# Altium schematic sheet Buttons_Buzzer.SchDoc
size A4
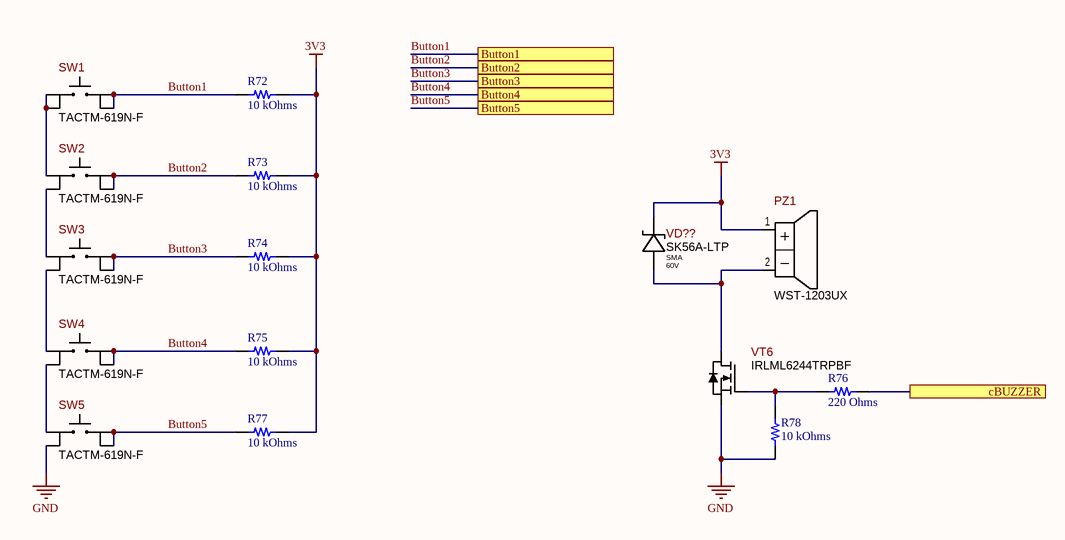
[diagram p0: Buttons_Buzzer.SchDoc]

## Parts
PZ1  WST-1203UX  [WST-1203UX]
R72  10 kOhms  [RES 0805_2012]
R73  10 kOhms  [RES 0805_2012]
R74  10 kOhms  [RES 0805_2012]
R75  10 kOhms  [RES 0805_2012]
R76  220 Ohms  [RES 0805_2012]
R77  10 kOhms  [RES 0805_2012]
R78  10 kOhms  [RES 0805_2012]
SW1  TACTM-619N-F  [TACTM-619N-F]
SW2  TACTM-619N-F  [TACTM-619N-F]
SW3  TACTM-619N-F  [TACTM-619N-F]
SW4  TACTM-619N-F  [TACTM-619N-F]
SW5  TACTM-619N-F  [TACTM-619N-F]
VD??  Package: SMA  Voltage: 60V  [SMA_MED]  (hidden comment: SK56A-LTP)
VT6  IRLML6244  [SOT-23_MED]  (value not drawn)

## Ports
Button1, Button2, Button3, Button4, Button5, cBUZZER

## Nets
3V3: PZ1.1(Positive) R72.1 R73.1 R74.1 R75.1 R77.1 VD??.CA
GND: R78.1 SW5.2 VT6.2(S)
Button1: R72.2 SW1.3 SW1.4 ; port Button1
Button2: R73.2 SW2.3 SW2.4 ; port Button2
Button3: R74.2 SW3.3 SW3.4 ; port Button3
Button4: R75.2 SW4.3 SW4.4 ; port Button4
Button5: R77.2 SW5.3 SW5.4 ; port Button5
cBUZZER: R76.1 ; port cBUZZER
NetPZ1_2: PZ1.2(Negative) VD??.AN VT6.3(D)
NetR76_2: R76.2 R78.2 VT6.1(G)
NetSW1_1: SW1.1 SW1.2 SW2.1
NetSW2_2: SW2.2 SW3.1
NetSW3_2: SW3.2 SW4.1
NetSW4_2: SW4.2 SW5.1

## Library data of the parts
PZ1 = WST-1203UX: Buzzers Indicator, Internally Driven Magnetic 3V 30mA 2.3kHz 82dB @ 3V, 10cm Through Hole; Manufacturer: Soberton; Ajax_1C_PN: NONE; Ajax_1С_Status: RND Only; Component Status: Released; Part Type: Buzzer; Component Type: PTH; Temperature Range: -20°C ~ 60°C; ComponentLink1URL: https://www.soberton.com/wp-content/uploads/2019/02/WST-1203UX.-17-Feb-2019-pdf.pdf; Supplier 1: Digi-Key; Supplier Part Number 1: 433-1047-ND; Replacement: NONE; Price: NONE; ComponentLink1Description: Datasheet; Part Number: WST-1203UX
R72-R75 R77 R78 = RNCS0805BKE10K0: RES 10K OHM 0.1% 1/10W 0805; Manufacturer: Stackpole Electronics Inc; Power (Watts): 0.1W, 1/10W; Temperature Coefficient: ±25ppm/°C; Part Number: RNCS0805BKE10K0; Value: 10 kOhms; ComponentLink1Description: Datasheet; ComponentLink1URL: https://www.seielect.com/catalog/sei-rncs_rnch.pdf; ComponentLink2Description: DigiKey Link; ComponentLink2URL: http://digikey.com/product-detail/en/stackpole-electronics-inc/RNCS0805BKE10K0/RNCS0805BKE10K0CT-ND/1800164; Composition: Thin Film; Device Package: 0805 (2012 Metric); Features: Anti-Corrosive, Automotive AEC-Q200, Moisture Resistant; Height - Seated (Max): 0.026" (0.65mm); LastUpdated: 02.09.2020 01:15:24; Lifecycle Status: Active; Minimum Order: 1; Number of Terminations: 2; Operating Temperature: -55°C ~ 155°C; Package / Case: 0805 (2012 Metric); Packaging: TapeAndReel; PartId: 27713; Part Status: Active; Price: 0.09; Ratings: AEC-Q200; Resistance: 10 kOhms; Series: RNCS; Size / Dimension: 0.079" L x 0.049" W (2.00mm x 1.25mm); Supplier 1: DigiKey; Supplier Part Number 1: RNCS0805BKE10K0CT-ND; Supplier Device Package: 0805; Tolerance: ±0.1%
R76 = CRGP0805F220R: CRGP 0805 220R 1%; Manufacturer: TE Connectivity Passive Product; Power (Watts): 0.333W, 1/3W; Temperature Coefficient: ±100ppm/°C; Part Number: CRGP0805F220R; Value: 220 Ohms; ComponentLink1Description: Datasheet; ComponentLink1URL: https://www.te.com/commerce/DocumentDelivery/DDEController?Action=srchrtrv&DocNm=9-1773463-9&DocType=DS&DocLang=English; ComponentLink2Description: DigiKey Link; ComponentLink2URL: http://digikey.com/product-detail/en/te-connectivity-passive-product/CRGP0805F220R/A130469CT-ND/8578301; Composition: Thick Film; Device Package: 0805 (2012 Metric); Features: Pulse Withstanding; Height - Seated (Max): 0.026" (0.65mm); LastUpdated: 02.09.2020 01:15:22; Lifecycle Status: Active; Minimum Order: 1; Number of Terminations: 2; Operating Temperature: -55°C ~ 155°C; Package / Case: 0805 (2012 Metric); Packaging: TapeAndReel; PartId: 28799; Part Status: Active; Price: 0.02; Resistance: 220 Ohms; Series: CRGP; Size / Dimension: 0.079" L x 0.049" W (2.00mm x 1.25mm); Supplier 1: DigiKey; Supplier Part Number 1: A130469CT-ND; Supplier Device Package: 0805; Tolerance: ±1%
SW1-SW5 = TACTM-619N-F: Tactile Switch SPST-NO 50mA 12V, 19mm Height; Manufacturer: Ninigi; Ajax_1C_ID: 20595; Ajax_1C_PN: Кнопка тактовая TACTM-619N-F; Ajax_1С_Status: RND Only; Component Status: On Review; Replacement: NONE; GUID_1C: 8084fd23-9e98-11ea-ab61-0050569f2651; Part Number: TACTM-619N-F; Part Type: Tactile Switch; Component Type: SMD; Temperature Range: -30°C ~ 85°C; ComponentLink1URL: https://www.tme.eu/Document/4775f6520ae2603ad81b86e79483fd89/TACTM-619N-F-DTE.pdf; Supplier 1: TME; Supplier Part Number 1: TACTM-619N-F; Price: 0,0953462; ComponentLink1Description: Datasheet
VD?? = SK56A-LTP: Diode Schottky 60V 5A, SMA; Manufacturer: Micro Commercial Co; Ajax_1C_ID: 12747; Ajax_1C_PN: SK56A-LTP диод; Ajax_1С_Status: Mass Production; Marking: SK56A; Component Status: Released; Standard Lead Time: 12 Weeks; Vf: 750mV @ 5A; Replacement: NONE; GUID_1C: b92aa543-5aa4-11e8-ab3c-0050569f2651; Part Number: SK56A-LTP; Part Type: Schottky; Component Type: SMD; Current: 5A; Temperature Range: -55°C ~ 150°C; ComponentLink1URL: https://www.mccsemi.com/pdf/Products/SK52A-L-SK510A-L(DO-214AC).pdf; Supplier 1: Digi-Key; Supplier Part Number 1: SK56A-LTPMSTR-ND; Price: 0,06; ComponentLink1Description: Datasheet
VT6 = IRLML6244TRPBF: 20V, 6.3A max N-Channel HEXFET MOSFET, 21mOhm @ Vgs = 4.5V; Manufacturer: Infineon Technologies; Rds: 27mOhm; Ajax_1C_ID: 5903; Ajax_1C_PN: IRLML6244TRPBF. полевой транзистор; Ajax_1С_Status: Mass Production; Component Status: Released; Standard Lead Time: 15 Weeks; Replacement: NONE; GUID_1C: 6032e646-a6d2-11e4-9c1d-a45d36c4a9e5; Part Number: IRLML6244TRPBF; Vds: 20V; Id: 6.3A; Package: SOT-23; Part Type: N-Channel; Component Type: SMD; Temperature Range: -55°C ~ 150°C; ComponentLink1URL: https://www.infineon.com/dgdl/irlml6244pbf.pdf?fileId=5546d462533600a4015356686fed261f; Supplier 1: Digi-Key; Supplier Part Number 1: IRLML6244TRPBFTR-ND; Price: 0,05; ComponentLink1Description: Datasheet